# EAGLE schematic temp v1 (EAGLE 9.7.0)
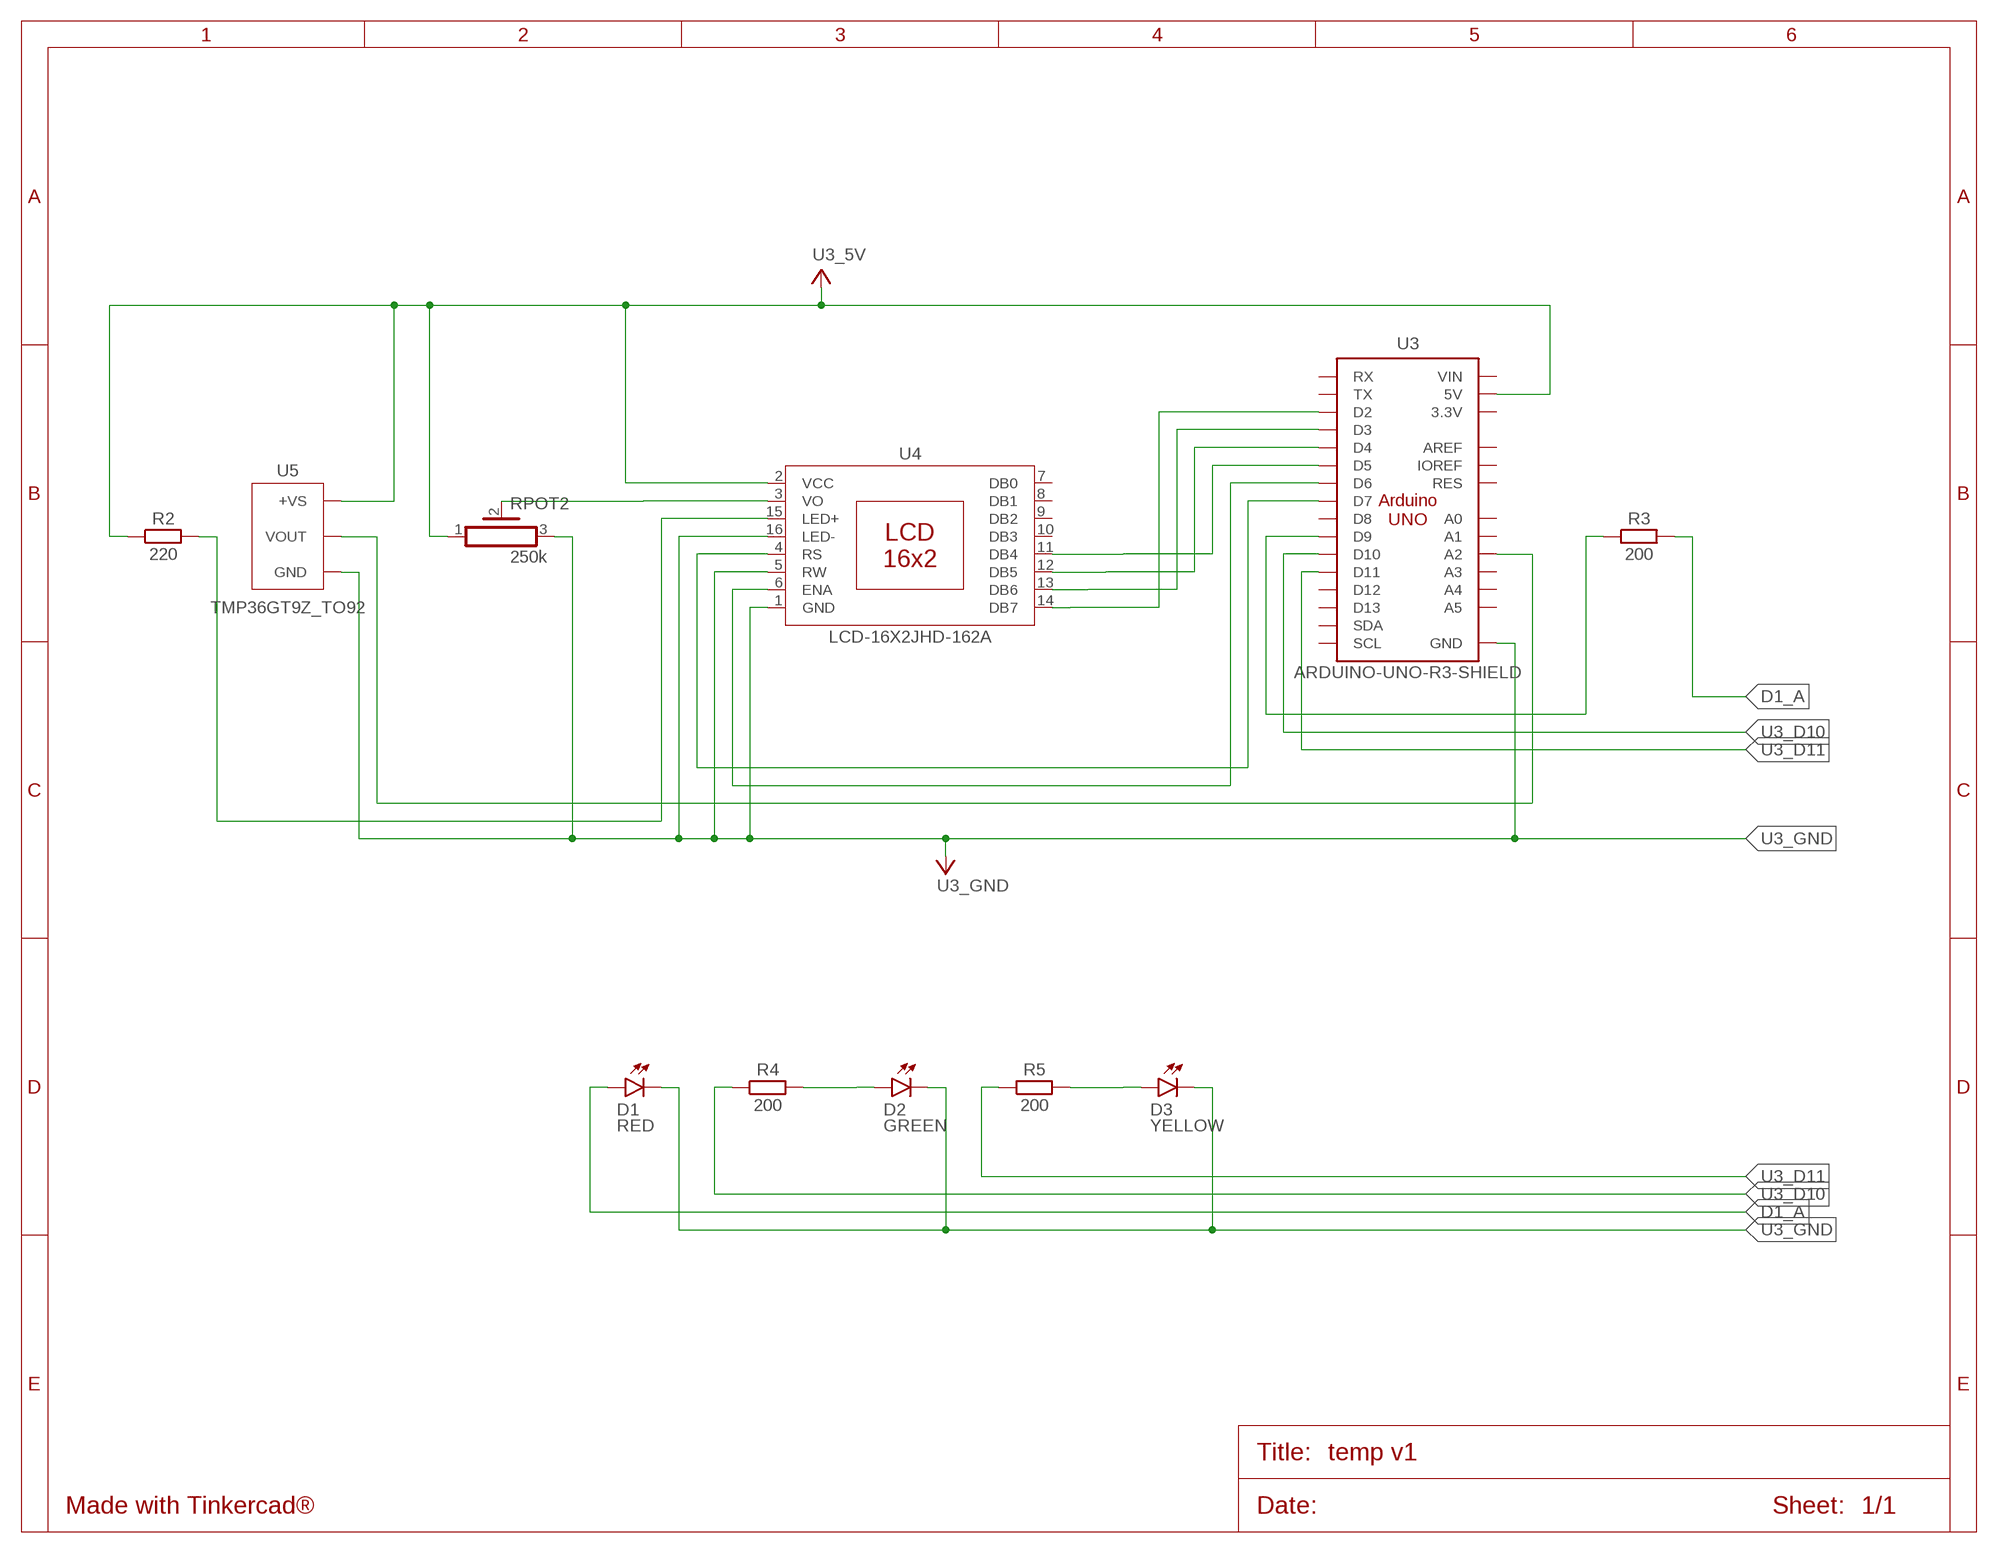
[diagram p0: schematic, sheet 1]

## Parts
D1  RED  LED_RADIAL_RED  [LEDRD254W60D565H860B]
D2  GREEN  LED_RADIAL_GREEN  [LEDRD254W60D565H860B_G]
D3  YELLOW  LED_RADIAL_YELLOW  [LEDRD254W60D565H860B_Y]
R2  220  RESISTOR_AXIAL-10.16MM-PITCH  [RESAD1016W63L850D250B]
R3  200  RESISTOR_AXIAL-10.16MM-PITCH  [RESAD1016W63L850D250B]
R4  200  RESISTOR_AXIAL-10.16MM-PITCH  [RESAD1016W63L850D250B]
R5  200  RESISTOR_AXIAL-10.16MM-PITCH  [RESAD1016W63L850D250B]
RPOT2  250k  POT_HA-06  [HA-06-SM065]
U3  ARDUINO-UNO-R3-SHIELD  [ARDUINO-UNO-R3-SHIELD]
U4  LCD-16X2JHD-162A  [JHD-162A]
U5  TMP36GT9Z_TO92  [TO92]

## Nets
D1_A: D1.1(A) R3.2
D2_A: D2.1(A) R4.2
D3_A: D3.1(A) R5.2
U3_5V: R2.1 RPOT2.1 U3.5V U4.2(VCC) U5.3(+VS)
U3_A2: U3.A2 U5.2(VOUT)
U3_D2: U3.D2 U4.14(DB7)
U3_D3: U3.D3 U4.13(DB6)
U3_D4: U3.D4 U4.12(DB5)
U3_D5: U3.D5 U4.11(DB4)
U3_D6: U3.D6 U4.6(ENA)
U3_D7: U3.D7 U4.4(RS)
U3_D9: R3.1 U3.D9
U3_D10: R4.1 U3.D10
U3_D11: R5.1 U3.D11
U3_GND: D1.2(C) D2.2(C) D3.2(C) RPOT2.3 U3.GND@0(GND) U3.GND@1(GND) U3.GND@2(GND) U4.1(GND) U4.5(RW) U4.16(LED-) U5.1(GND)
U4_LED+: R2.2 U4.15(LED+)
U4_VO: RPOT2.2 U4.3(VO)
Unconnected: U3.3.3V U3.A0 U3.A1 U3.A3 U3.A4 U3.A5 U3.AREF U3.D8 U3.D12 U3.D13 U3.IOREF U3.RES U3.RX U3.SCL U3.SDA U3.TX U3.VIN U4.7(DB0) U4.8(DB1) U4.9(DB2) U4.10(DB3)

## Library data of the parts
D1 = Tinkercad:LED_RADIAL: LED - Generic; CATEGORY: Opto-Electronic; SUB-CATEGORY: LED; VALUE: LED_RED
D2 = Tinkercad:LED_RADIAL: LED - Generic; CATEGORY: Opto-Electronic; SUB-CATEGORY: LED; VALUE: LED_GREEN
D3 = Tinkercad:LED_RADIAL: LED - Generic; CATEGORY: Opto-Electronic; SUB-CATEGORY: LED; VALUE: LED_YELLOW
R2-R5 = Tinkercad:RESISTOR: Resistor Fixed - Generic
RPOT2 = Tinkercad:POT: Rectangular Trimmer Potentiometers - PV36 Series Datasheet <https://www.bourns.com/docs/Product-Datasheets/pv36.pdf>
U3 = Tinkercad:ARDUINO-UNO-R3-SHIELD
U4 = Tinkercad:LCD-16X2
U5 = Tinkercad:TMP36GT9Z: SENSOR ANALOG -40C-125C